# Altium schematic sheet up.SchDoc
size A; SheetNumber: 2; SheetTotal: 2
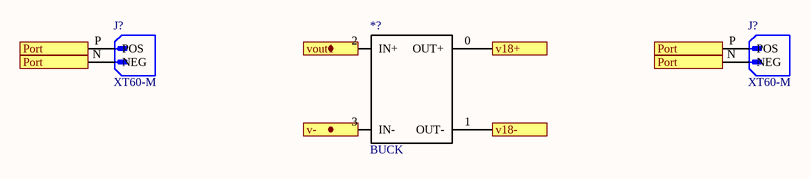
[diagram p0: up.SchDoc]

## Parts
(Parts that share a designator on the sheet are numbered #1, #2 ... from top to bottom, then left to right.)
*?  BUCK
J?#1  XT60-M  [AMASS_XT60-M]
J?#2  XT60-M  [AMASS_XT60-M]

## Ports
Port, v18+ (out), v18- (out), v- (in), vout1 (in)

## Nets
Port: J?#1.N(NEG) J?#1.P(POS) J?#2.N(NEG) J?#2.P(POS) ; port Port
v18+: *?.0(OUT+) ; port v18+
v18-: *?.1(OUT-) ; port v18-

Not connected (* = marked no-connect by the designer): *? 2(IN+) 3(IN-)

## Library data of the parts
J?#1 J?#2 = XT60-M: Plug; DC supply; XT60; male; PIN: 2; for cable; soldered; 30A; 500V; MF: AMASS; Package: Package; Availability: Not in stock; SnapEDA_Link: https://www.snapeda.com/parts/XT60-M/AMASS/view-part/?ref=snap; Check_prices: https://www.snapeda.com/parts/XT60-M/AMASS/view-part/?ref=eda; MP: XT60-M; Price: None; Value: *